# Altium schematic sheet [1]-Power Pins Page of RK3399.SchDoc: RK3399 SOM Board Design V1.0
size A3; Author: ABC; Organization: Altium Limited; Address1: L3, 12a Rodborough Rd; Address2: Frenchs Forest; Address3: NSW; Address4: Australia 2086; DocumentNumber: 3; SheetNumber: 3; SheetTotal: 21; PROJECT CODE: A_V1.0
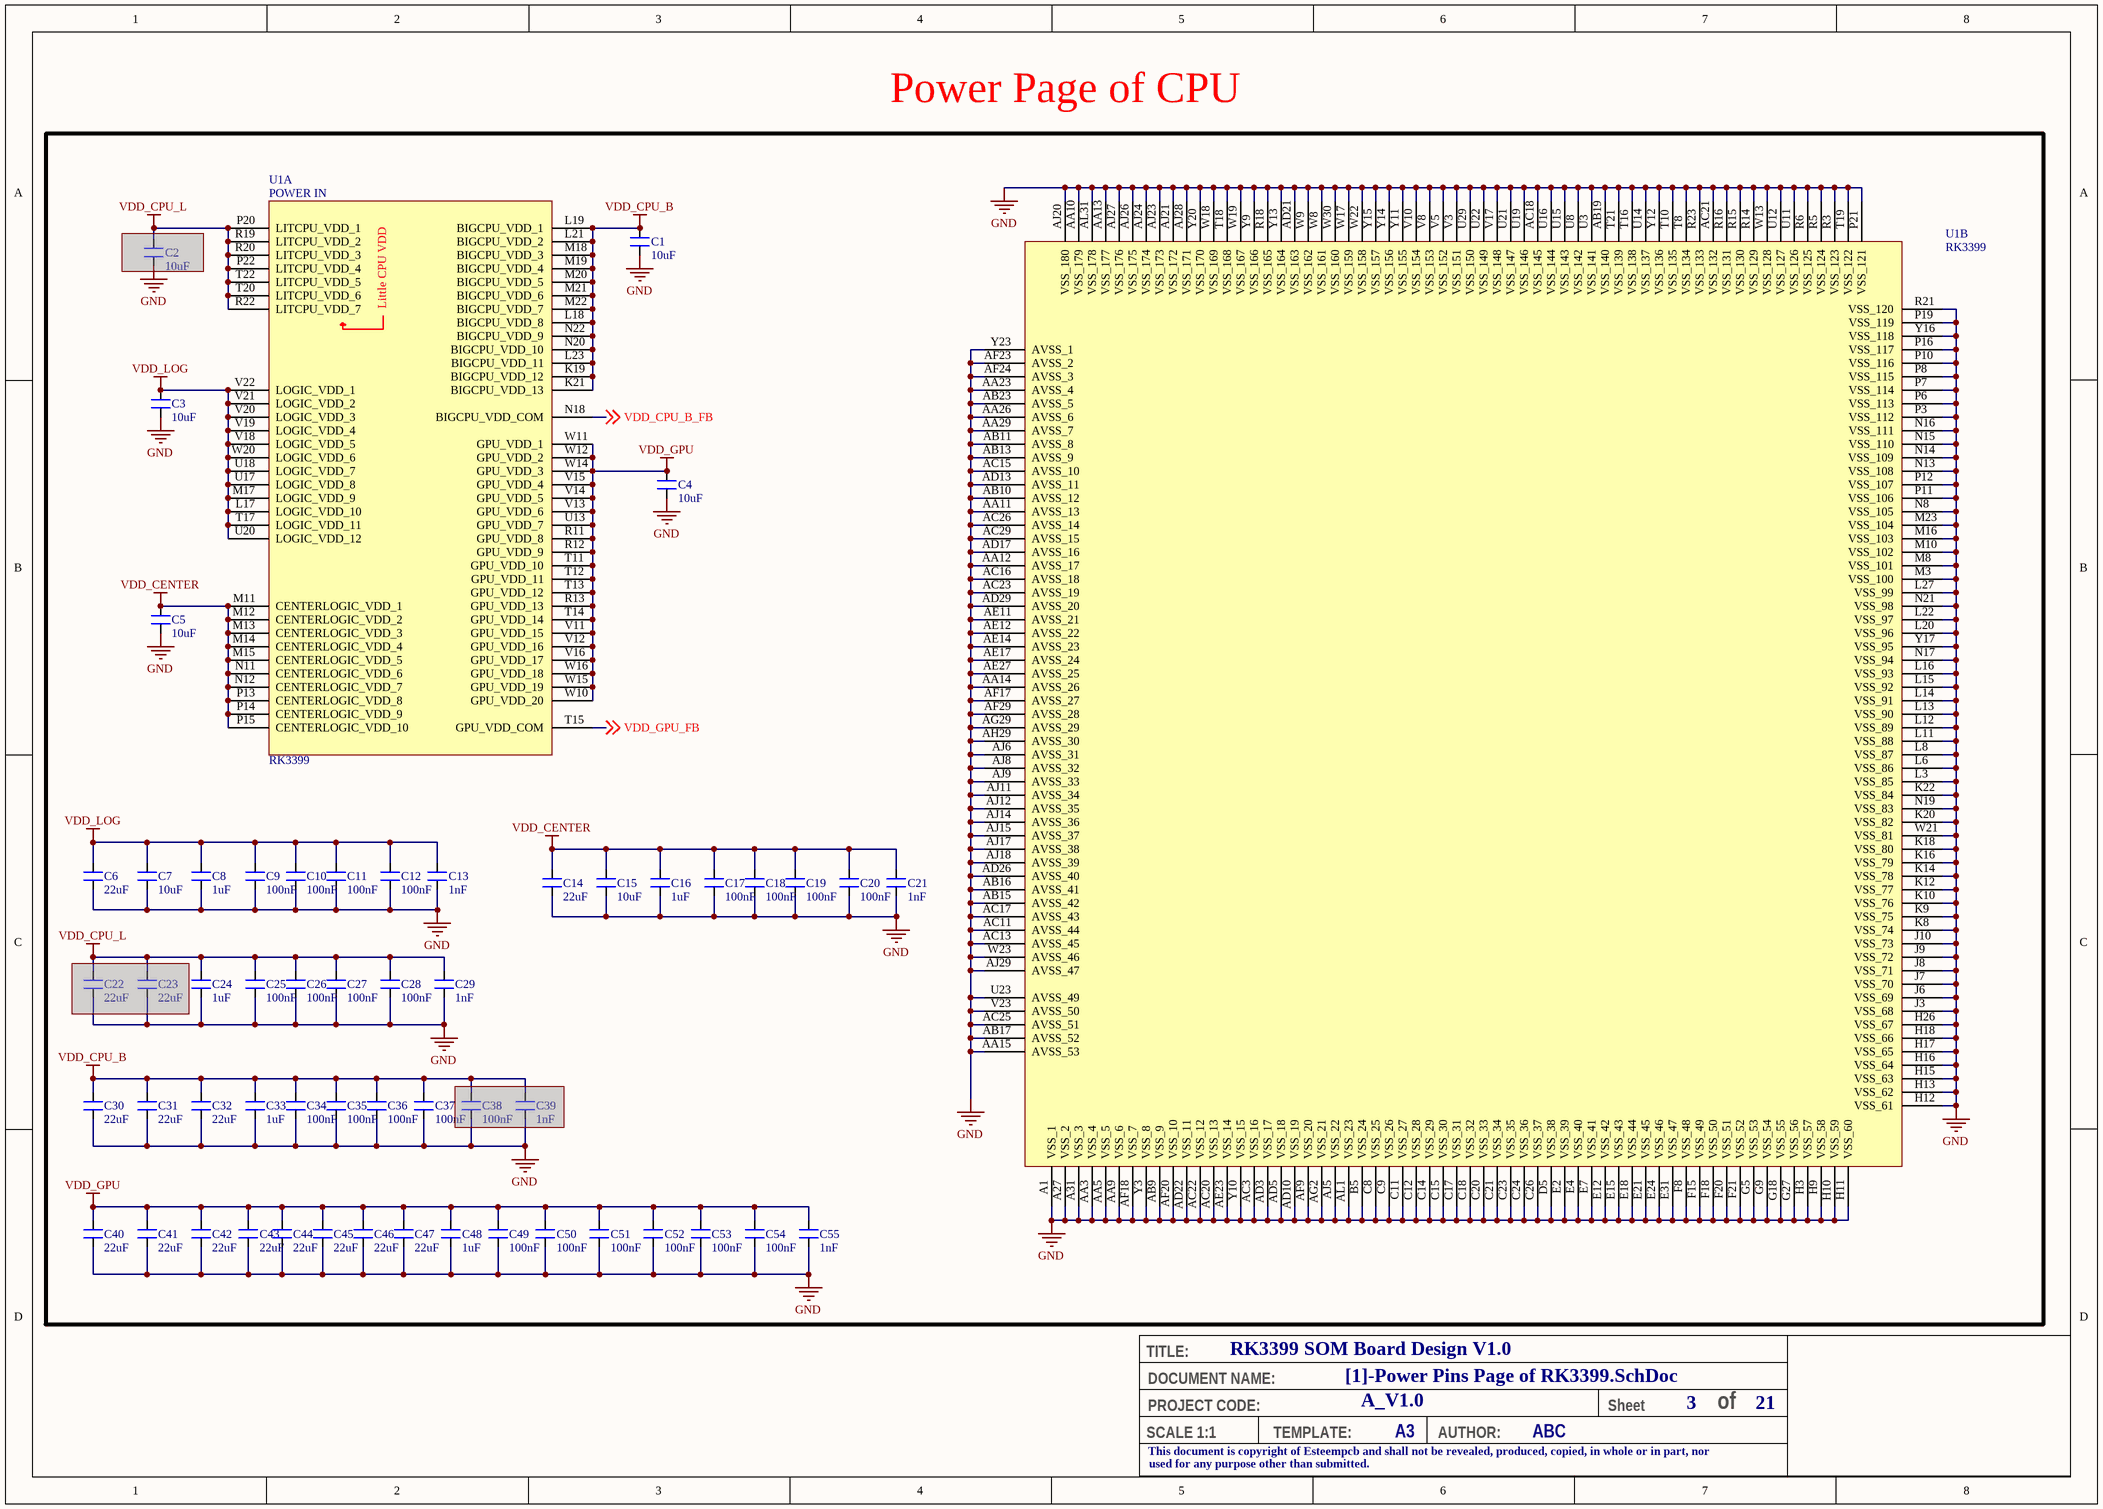
[diagram p0: [1]-Power Pins Page of RK3399.SchDoc]

## Parts
C1  10uF  [CAP_0402]
C2  10uF  [CAP_0402]  (masked out: inside a compile mask, not in the netlist)
C3  10uF  [CAP_0402]
C4  10uF  [CAP_0402]
C5  10uF  [CAP_0402]
C6  22uF  [CAP_0402]
C7  10uF  [CAP_0402]
C8  1uF  [CAP_0201]
C9  100nF  [CAP_0201]
C10  100nF  [CAP_0201]
C11  100nF  [CAP_0201]
C12  100nF  [CAP_0201]
C13  1nF  [CAP_0201]
C14  22uF  [CAP_0402]
C15  10uF  [CAP_0402]
C16  1uF  [CAP_0201]
C17  100nF  [CAP_0201]
C18  100nF  [CAP_0201]
C19  100nF  [CAP_0201]
C20  100nF  [CAP_0201]
C21  1nF  [CAP_0201]
C22  22uF  [CAP_0402]  (masked out: inside a compile mask, not in the netlist)
C23  22uF  [CAP_0402]  (masked out: inside a compile mask, not in the netlist)
C24  1uF  [CAP_0201]
C25  100nF  [CAP_0201]
C26  100nF  [CAP_0201]
C27  100nF  [CAP_0201]
C28  100nF  [CAP_0201]
C29  1nF  [CAP_0201]
C30  22uF  [CAP_0402]
C31  22uF  [CAP_0402]
C32  22uF  [CAP_0402]
C33  1uF  [CAP_0201]
C34  100nF  [CAP_0201]
C35  100nF  [CAP_0201]
C36  100nF  [CAP_0201]
C37  100nF  [CAP_0201]
C38  100nF  [CAP_0201]  (masked out: inside a compile mask, not in the netlist)
C39  1nF  [CAP_0201]  (masked out: inside a compile mask, not in the netlist)
C40  22uF  [CAP_0402]
C41  22uF  [CAP_0402]
C42  22uF  [CAP_0402]
C43  22uF  [CAP_0402]
C44  22uF  [CAP_0402]
C45  22uF  [CAP_0402]
C46  22uF  [CAP_0402]
C47  22uF  [CAP_0402]
C48  1uF  [CAP_0201]
C49  100nF  [CAP_0201]
C50  100nF  [CAP_0201]
C51  100nF  [CAP_0201]
C52  100nF  [CAP_0201]
C53  100nF  [CAP_0201]
C54  100nF  [CAP_0201]
C55  1nF  [CAP_0201]
U1  RK3399  [FBGA828_23_826X826]  (parts A,B of 24)

## Nets
GND: C1.1 C3.1 C4.1 C5.1 C6.1 C7.1 C8.1 C9.1 C10.1 C11.1 C12.1 C13.1 C14.1 C15.1 C16.1 C17.1 C18.1 C19.1 C20.1 C21.1 C24.1 C25.1 C26.1 C27.1 C28.1 C29.1 C30.1 C31.1 C32.1 C33.1 C34.1 C35.1 C36.1 C37.1 C40.1 C41.1 C42.1 C43.1 C44.1 C45.1 C46.1 C47.1 C48.1 C49.1 C50.1 C51.1 C52.1 C53.1 C54.1 C55.1 U1.A1(VSS_1) U1.A27(VSS_2) U1.A31(VSS_3) U1.AA3(VSS_4) U1.AA5(VSS_5) U1.AA9(VSS_6) U1.AA10(VSS_179) U1.AA11(AVSS_13) U1.AA12(AVSS_17) U1.AA13(VSS_177) U1.AA14(AVSS_26) U1.AA15(AVSS_53) U1.AA23(AVSS_4) U1.AA26(AVSS_6) U1.AA29(AVSS_7) U1.AB9(VSS_9) U1.AB10(AVSS_12) U1.AB11(AVSS_8) U1.AB13(AVSS_9) U1.AB15(AVSS_42) U1.AB16(AVSS_41) U1.AB17(AVSS_52) U1.AB19(VSS_140) U1.AB23(AVSS_5) U1.AC3(VSS_16) U1.AC11(AVSS_44) U1.AC13(AVSS_45) U1.AC15(AVSS_10) U1.AC16(AVSS_18) U1.AC17(AVSS_43) U1.AC18(VSS_145) U1.AC20(VSS_13) U1.AC21(VSS_132) U1.AC22(VSS_12) U1.AC23(AVSS_19) U1.AC25(AVSS_51) U1.AC26(AVSS_14) U1.AC29(AVSS_15) U1.AD3(VSS_17) U1.AD5(VSS_18) U1.AD10(VSS_19) U1.AD13(AVSS_11) U1.AD17(AVSS_16) U1.AD21(VSS_163) U1.AD22(VSS_11) U1.AD26(AVSS_40) U1.AD29(AVSS_20) U1.AE11(AVSS_21) U1.AE12(AVSS_22) U1.AE14(AVSS_23) U1.AE17(AVSS_24) U1.AE23(VSS_14) U1.AE27(AVSS_25) U1.AF9(VSS_20) U1.AF17(AVSS_27) U1.AF18(VSS_7) U1.AF20(VSS_10) U1.AF23(AVSS_2) U1.AF24(AVSS_3) U1.AF29(AVSS_28) U1.AG2(VSS_21) U1.AG29(AVSS_29) U1.AH29(AVSS_30) U1.AJ5(VSS_22) U1.AJ6(AVSS_31) U1.AJ8(AVSS_32) U1.AJ9(AVSS_33) U1.AJ11(AVSS_34) U1.AJ12(AVSS_35) U1.AJ14(AVSS_36) U1.AJ15(AVSS_37) U1.AJ17(AVSS_38) U1.AJ18(AVSS_39) U1.AJ20(VSS_180) U1.AJ21(VSS_172) U1.AJ23(VSS_173) U1.AJ24(VSS_174) U1.AJ26(VSS_175) U1.AJ27(VSS_176) U1.AJ28(VSS_171) U1.AJ29(AVSS_47) U1.AL1(VSS_23) U1.AL31(VSS_178) U1.B5(VSS_24) U1.C8(VSS_25) U1.C9(VSS_26) U1.C11(VSS_27) U1.C12(VSS_28) U1.C14(VSS_29) U1.C15(VSS_30) U1.C17(VSS_31) U1.C18(VSS_32) U1.C20(VSS_33) U1.C21(VSS_34) U1.C23(VSS_35) U1.C24(VSS_36) U1.C26(VSS_37) U1.D5(VSS_38) U1.E2(VSS_39) U1.E4(VSS_40) U1.E7(VSS_41) U1.E12(VSS_42) U1.E15(VSS_43) U1.E18(VSS_44) U1.E21(VSS_45) U1.E24(VSS_46) U1.E31(VSS_47) U1.F8(VSS_48) U1.F15(VSS_49) U1.F18(VSS_50) U1.F20(VSS_51) U1.F21(VSS_52) U1.G5(VSS_53) U1.G9(VSS_54) U1.G18(VSS_55) U1.G27(VSS_56) U1.H3(VSS_57) U1.H9(VSS_58) U1.H10(VSS_59) U1.H11(VSS_60) U1.H12(VSS_61) U1.H13(VSS_62) U1.H15(VSS_63) U1.H16(VSS_64) U1.H17(VSS_65) U1.H18(VSS_66) U1.H26(VSS_67) U1.J3(VSS_68) U1.J6(VSS_69) U1.J7(VSS_70) U1.J8(VSS_71) U1.J9(VSS_72) U1.J10(VSS_73) U1.K8(VSS_74) U1.K9(VSS_75) U1.K10(VSS_76) U1.K12(VSS_77) U1.K14(VSS_78) U1.K16(VSS_79) U1.K18(VSS_80) U1.K20(VSS_82) U1.K22(VSS_84) U1.L3(VSS_85) U1.L6(VSS_86) U1.L8(VSS_87) U1.L11(VSS_88) U1.L12(VSS_89) U1.L13(VSS_90) U1.L14(VSS_91) U1.L15(VSS_92) U1.L16(VSS_93) U1.L20(VSS_96) U1.L22(VSS_97) U1.L27(VSS_99) U1.M3(VSS_100) U1.M8(VSS_101) U1.M10(VSS_102) U1.M16(VSS_103) U1.M23(VSS_104) U1.N8(VSS_105) U1.N13(VSS_108) U1.N14(VSS_109) U1.N15(VSS_110) U1.N16(VSS_111) U1.N17(VSS_94) U1.N19(VSS_83) U1.N21(VSS_98) U1.P3(VSS_112) U1.P6(VSS_113) U1.P7(VSS_114) U1.P8(VSS_115) U1.P10(VSS_116) U1.P11(VSS_106) U1.P12(VSS_107) U1.P16(VSS_117) U1.P19(VSS_119) U1.P21(VSS_121) U1.R3(VSS_123) U1.R5(VSS_124) U1.R6(VSS_125) U1.R14(VSS_129) U1.R15(VSS_130) U1.R16(VSS_131) U1.R18(VSS_165) U1.R21(VSS_120) U1.R23(VSS_133) U1.T8(VSS_134) U1.T10(VSS_135) U1.T16(VSS_138) U1.T18(VSS_168) U1.T19(VSS_122) U1.T21(VSS_139) U1.U3(VSS_141) U1.U8(VSS_142) U1.U11(VSS_126) U1.U12(VSS_127) U1.U14(VSS_137) U1.U15(VSS_143) U1.U16(VSS_144) U1.U19(VSS_146) U1.U21(VSS_147) U1.U22(VSS_149) U1.U23(AVSS_49) U1.U29(VSS_150) U1.V3(VSS_151) U1.V5(VSS_152) U1.V8(VSS_153) U1.V10(VSS_154) U1.V17(VSS_148) U1.V23(AVSS_50) U1.W8(VSS_161) U1.W9(VSS_162) U1.W13(VSS_128) U1.W17(VSS_159) U1.W18(VSS_169) U1.W19(VSS_167) U1.W21(VSS_81) U1.W22(VSS_158) U1.W23(AVSS_46) U1.W30(VSS_160) U1.Y3(VSS_8) U1.Y9(VSS_166) U1.Y10(VSS_15) U1.Y11(VSS_155) U1.Y12(VSS_136) U1.Y13(VSS_164) U1.Y14(VSS_156) U1.Y15(VSS_157) U1.Y16(VSS_118) U1.Y17(VSS_95) U1.Y20(VSS_170) U1.Y23(AVSS_1)
VDD_CENTER: C5.2 C14.2 C15.2 C16.2 C17.2 C18.2 C19.2 C20.2 C21.2 U1.M11(CENTERLOGIC_VDD_1) U1.M12(CENTERLOGIC_VDD_2) U1.M13(CENTERLOGIC_VDD_3) U1.M14(CENTERLOGIC_VDD_4) U1.M15(CENTERLOGIC_VDD_5) U1.N11(CENTERLOGIC_VDD_6) U1.N12(CENTERLOGIC_VDD_7) U1.P13(CENTERLOGIC_VDD_8) U1.P14(CENTERLOGIC_VDD_9) U1.P15(CENTERLOGIC_VDD_10)
VDD_CPU_B: C1.2 C30.2 C31.2 C32.2 C33.2 C34.2 C35.2 C36.2 C37.2 U1.K19(BIGCPU_VDD_12) U1.K21(BIGCPU_VDD_13) U1.L18(BIGCPU_VDD_8) U1.L19(BIGCPU_VDD_1) U1.L21(BIGCPU_VDD_2) U1.L23(BIGCPU_VDD_11) U1.M18(BIGCPU_VDD_3) U1.M19(BIGCPU_VDD_4) U1.M20(BIGCPU_VDD_5) U1.M21(BIGCPU_VDD_6) U1.M22(BIGCPU_VDD_7) U1.N20(BIGCPU_VDD_10) U1.N22(BIGCPU_VDD_9)
VDD_CPU_L: C24.2 C25.2 C26.2 C27.2 C28.2 C29.2 U1.P20(LITCPU_VDD_1) U1.P22(LITCPU_VDD_4) U1.R19(LITCPU_VDD_2) U1.R20(LITCPU_VDD_3) U1.R22(LITCPU_VDD_7) U1.T20(LITCPU_VDD_6) U1.T22(LITCPU_VDD_5)
VDD_GPU: C4.2 C40.2 C41.2 C42.2 C43.2 C44.2 C45.2 C46.2 C47.2 C48.2 C49.2 C50.2 C51.2 C52.2 C53.2 C54.2 C55.2 U1.R11(GPU_VDD_8) U1.R12(GPU_VDD_9) U1.R13(GPU_VDD_13) U1.T11(GPU_VDD_10) U1.T12(GPU_VDD_11) U1.T13(GPU_VDD_12) U1.T14(GPU_VDD_14) U1.U13(GPU_VDD_7) U1.V11(GPU_VDD_15) U1.V12(GPU_VDD_16) U1.V13(GPU_VDD_6) U1.V14(GPU_VDD_5) U1.V15(GPU_VDD_4) U1.V16(GPU_VDD_17) U1.W10(GPU_VDD_20) U1.W11(GPU_VDD_1) U1.W12(GPU_VDD_2) U1.W14(GPU_VDD_3) U1.W15(GPU_VDD_19) U1.W16(GPU_VDD_18)
VDD_LOG: C3.2 C6.2 C7.2 C8.2 C9.2 C10.2 C11.2 C12.2 C13.2 U1.L17(LOGIC_VDD_10) U1.M17(LOGIC_VDD_9) U1.T17(LOGIC_VDD_11) U1.U17(LOGIC_VDD_8) U1.U18(LOGIC_VDD_7) U1.U20(LOGIC_VDD_12) U1.V18(LOGIC_VDD_5) U1.V19(LOGIC_VDD_4) U1.V20(LOGIC_VDD_3) U1.V21(LOGIC_VDD_2) U1.V22(LOGIC_VDD_1) U1.W20(LOGIC_VDD_6)
VDD_CPU_B_FB: U1.N18(BIGCPU_VDD_COM) ; off-sheet VDD_CPU_B_FB
VDD_GPU_FB: U1.T15(GPU_VDD_COM) ; off-sheet VDD_GPU_FB

## Notes on the sheet
- Power Page of CPU
- TITLE:
- DOCUMENT NAME:
- SCALE 1:1
- This document is copyright of Esteempcb and shall not be revealed, produced, copied, in whole or in part, nor
- PROJECT CODE:
- TEMPLATE:
- A3
- AUTHOR:
- Sheet
- of
- used for any purpose other than submitted.
- (in symbol IC_RK3399-FCBGA828, part A) POWER IN; Little CPU VDD

## Library data of the parts
C1-C5 C7 C15 = CAP_10uF-10V-20%-0402: 10µF ±20% 10V Ceramic Capacitor X5R 0402 (1005 Metric) /; Manufacturer Part Number: CL05A106MP5NUNC; Manufacturer: Samsung Electro-Mechanics; Case/Package: 0402; Supplier-1: Digikey
C6 C14 C22 C23 C30-C32 C40-C47 = CAP_22uF-6.3V-20%-0402: 22µF ±20% 6.3V Ceramic Capacitor X5R 0402 (1005 Metric) /; Manufacturer: Murata Electronics; Manufacturer Part Number: CL05A226MQ5N6J8; Case/Package: 0402; Supplier-1: Digikey
C8 C16 C24 C33 C48 = CAP_1uF-16V-10%-0201: 1µF ±20% 16V Ceramic Capacitor X5R 0201 (0603 Metric) /; Manufacturer: Samsung Electro-Mechanics; Manufacturer Part Number: CL03A105MO3NRNH; Case/Package: 0201; Supplier-1: Digikey
C9-C12 C17-C20 C25-C28 C34-C38 C49-C54 = CAP_100nF-25V-10%-0201: 0.1µF ±10% 25V Ceramic Capacitor X5R 0201 (0603 Metric) /; Manufacturer: TDK Corporation; Manufacturer Part Number: C0603X5R1E104K030BB; Case/Package: 0201; Supplier-1: Digikey
C13 C21 C29 C39 C55 = CAP_1nF-16V-10%-0201: 1000pF ±10% 16V Ceramic Capacitor X7R 0201 (0603 Metric) /; Manufacturer: Murata Electronics; Manufacturer Part Number: GRM033R71C102KA01D; Case/Package: 0201; Supplier-1: Digikey
U1 = IC_RK3399-FCBGA828: RK3399 is a low power, high performance processor for computing, personal mobile.; Manufacturer: Rockchip; Manufacturer Part Number: RK3399; Case/Package: FCBGA828; Supplier-1: Rockchip